# EAGLE design m328prog (EAGLE 9.4.2)
DESIGNER: K. ISOM
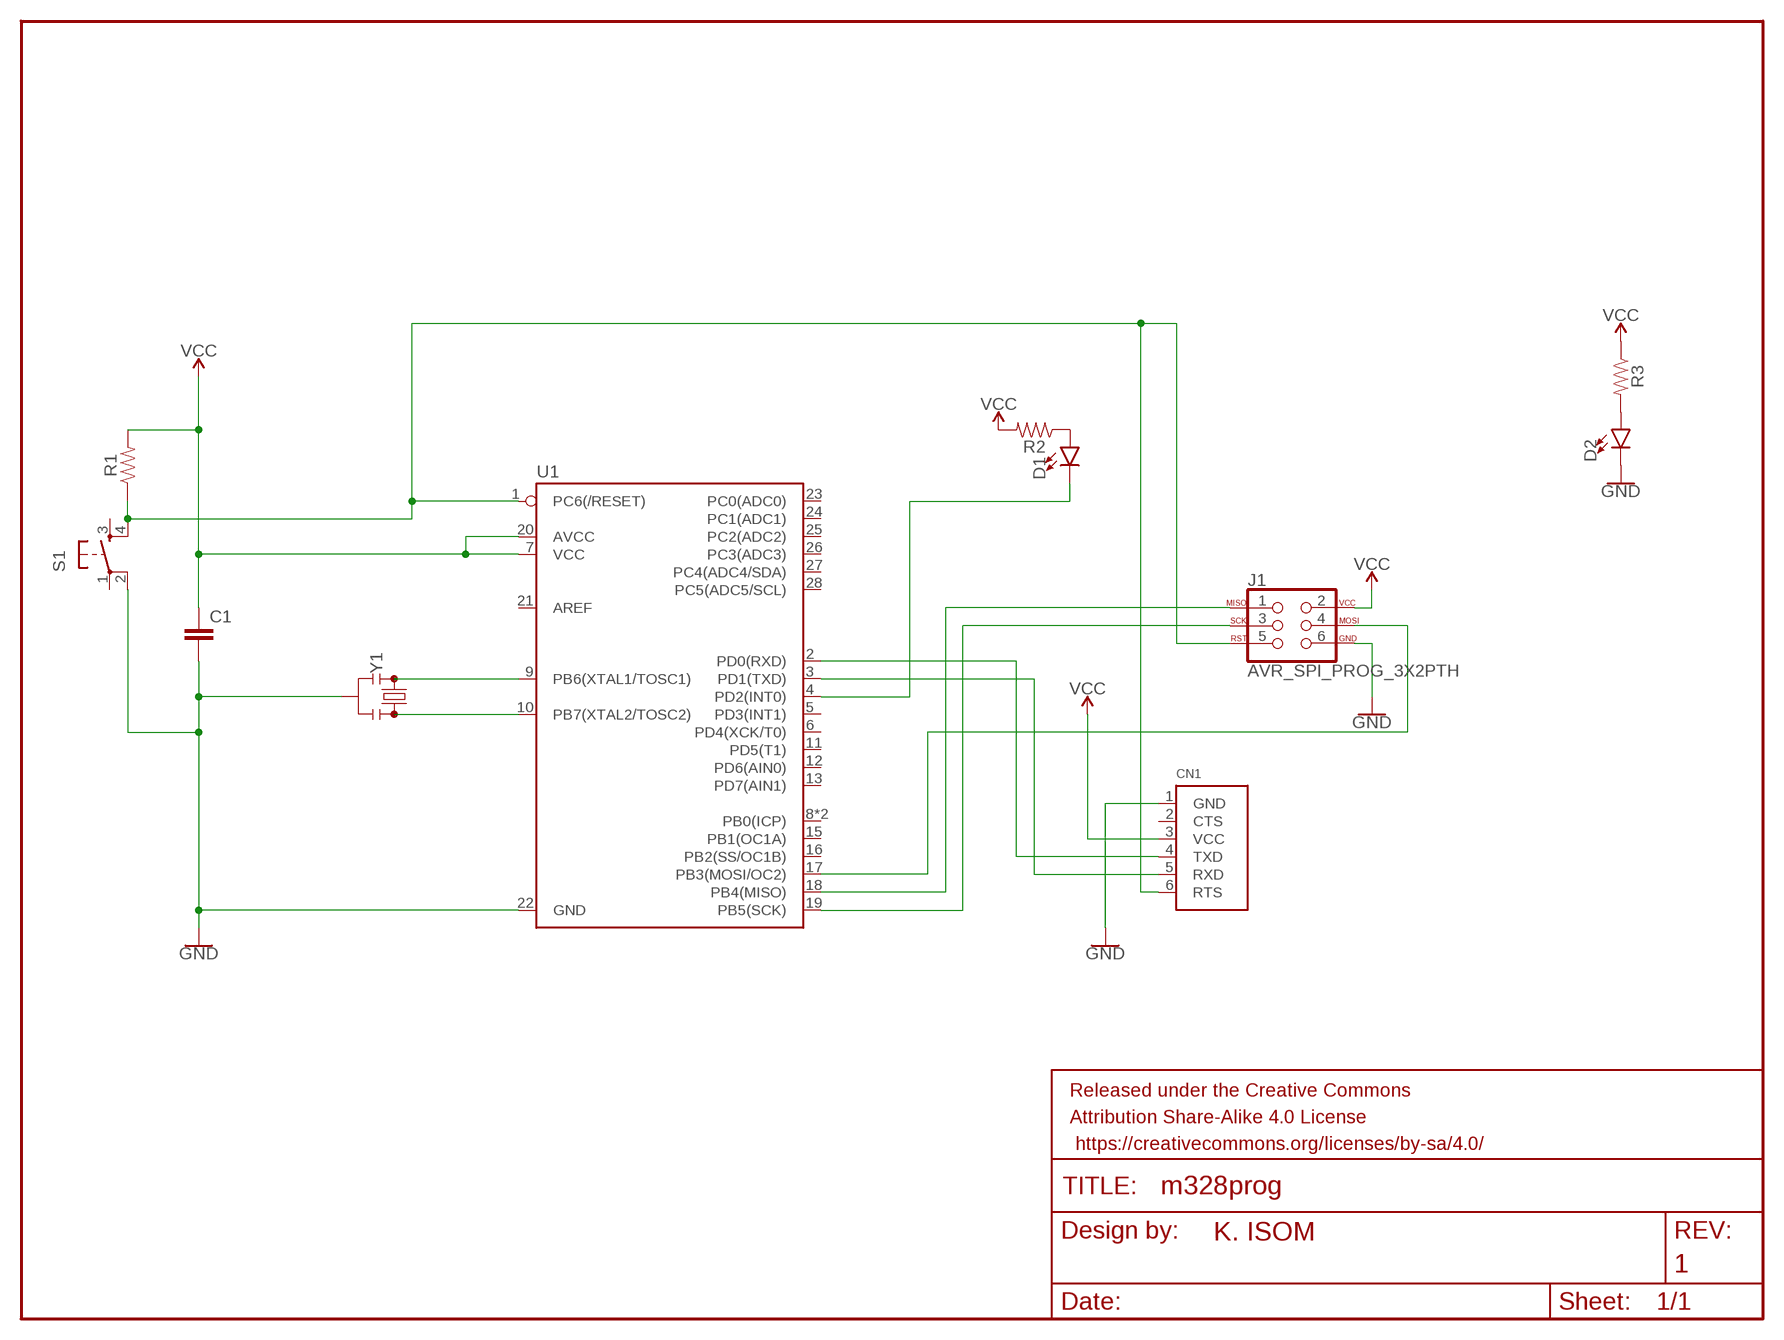
[diagram p0: schematic, sheet 1]

## Parts
C1  C2,5-3  [C2.5-3]
CN1  FTDIUSBCABLE  [1X06_ROUND]
D1  LED3MM  [LED_3MM]
D2  LED3MM  [LED_3MM]
FRAME1  FRAME-LETTER  [CREATIVE_COMMONS]
J1  AVR_SPI_PROG_3X2PTH  [2X3]
R1  RESISTORAXIAL-0.3  [AXIAL-0.3]
R2  RESISTORAXIAL-0.3  [AXIAL-0.3]
R3  RESISTORAXIAL-0.3  [AXIAL-0.3]
S1  TAC_SWITCHPTH  [TACTILE-PTH]
U1  ATMEGA328P  [DIL28-3-ZIF_SOCKET]
Y1  RESONATORPTH-7.6X3.8  [RESONATOR-PTH-7.6X3.8]

## Nets
GND: C1.2 CN1.1(GND) D2.K(C) J1.6 S1.2 U1.22(GND) Y1.2
N$1: U1.9(PB6(XTAL1/TOSC1)) Y1.1
N$2: U1.10(PB7(XTAL2/TOSC2)) Y1.3
N$3: J1.4 U1.17(PB3(MOSI/OC2))
N$4: CN1.6(RTS) J1.5 R1.P$1 S1.4 U1.1(PC6(/RESET))
N$5: J1.1 U1.18(PB4(MISO))
N$6: J1.3 U1.19(PB5(SCK))
N$7: D1.K(C) U1.4(PD2(INT0))
N$8: D1.A R2.P$1
N$9: CN1.5(RXD) U1.3(PD1(TXD))
N$10: CN1.4(TXD) U1.2(PD0(RXD))
N$11: D2.A R3.P$2
VCC: C1.1 CN1.3(VCC) J1.2 R1.P$2 R2.P$2 R3.P$1 U1.7(VCC) U1.20(AVCC)
Unconnected: CN1.2(CTS) S1.1 S1.3 U1.5(PD3(INT1)) U1.6(PD4(XCK/T0)) U1.8(PB0(ICP)) U1.11(PD5(T1)) U1.12(PD6(AIN0)) U1.13(PD7(AIN1)) U1.14(PB0(ICP)) U1.15(PB1(OC1A)) U1.16(PB2(SS/OC1B)) U1.21(AREF) U1.23(PC0(ADC0)) U1.24(PC1(ADC1)) U1.25(PC2(ADC2)) U1.26(PC3(ADC3)) U1.27(PC4(ADC4/SDA)) U1.28(PC5(ADC5/SCL))

## Library data of the parts
C1 = capacitor-wima:C: CAPACITOR naming: grid - package width
CN1 = microbuilder:FTDIUSBCABLE: FTDI TTL-232R USB Cable Connector for FTDI's USB->RS232 Cable
D1 D2 = SparkFun-LED:LED: LED (Generic) Standard schematic elements and footprints for 5mm, 3mm, 1206, and 0603 sized LEDs. Generic LEDs with no color specified.; PROD_ID: DIO-08794
FRAME1 = SparkFun-Aesthetics:FRAME-LETTER: Schematic Frame - Letter Standard 8.5x11 US Letter frame; DESIGNER: K. ISOM; REV: 1
J1 = SparkFun-Connectors:AVR_SPI_PROG_3X2: AVR ISP 6 Pin This is the reduced ISP connector for AVR programming. Common on Arduino. This footprint will take up less PCB space and can be used with a 10-pin to 6-pin adapter such as SKU: BOB-08508 **Special note about "TEST_POINT" package. The stop mask is on the top side, so if you want your programming test points to be on the bottom of your board, make sure to place this package on the bottom side of the board. This also ensure that the orientation to program from the bottom side will be correct. SparkFun Products: SparkFun ISP Pogo Adapter <https://www.sparkfun.com/products/11591> - NS Tiny AVR Programmer <https://www.sparkfun.com/products/11801> -PTH
R1-R3 = SparkFun-Resistors:RESISTOR: Generic Resistor Package
S1 = SparkFun-Retired:TAC_SWITCH: Momentary Switch Button commonly used for reset or general input. Spark Fun Electronics SKU : COM-00097 SMT- SWCH-08247
U1 = wntrmute:ATMEGA328P
Y1 = SparkFun-Clocks:RESONATOR: Resonators (Generic) Ceramic resonators are clock-generating components, often used to control timing in microcontrollers. They usually have 3 pins: two pins for oscillation, and one pin for ground. Compared to crystals, resonators have worse tolerance, but are usually much cheaper. Plus, they have built-in load capacitors! These devices are used on boards like the Arduino Pro 8MHz <https://www.sparkfun.com/products/11114> and Arduino Pro 16MHz <https://www.sparkfun.com/products/11113>.

## Net classes
0 default: width 0.152 mm, drill 0.254 mm, clearance 0.152 mm

## Board
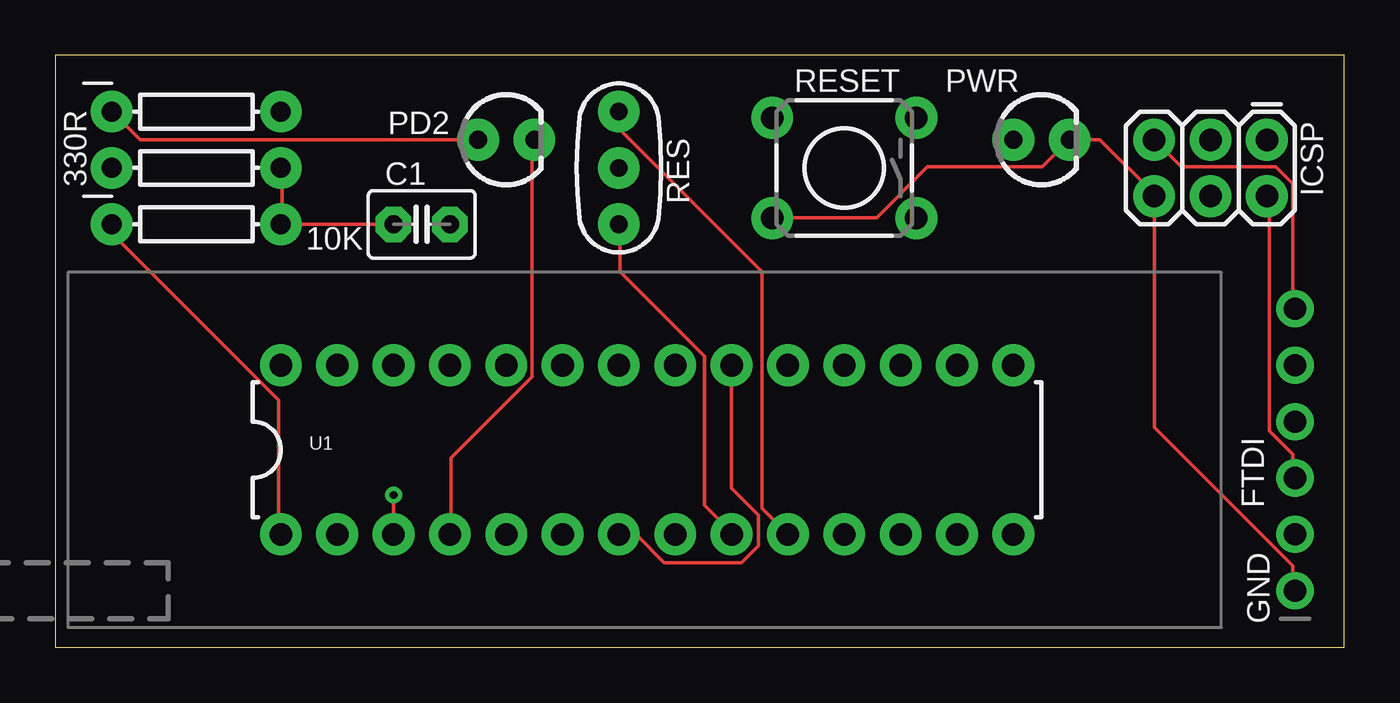
[diagram p1: board, top side]
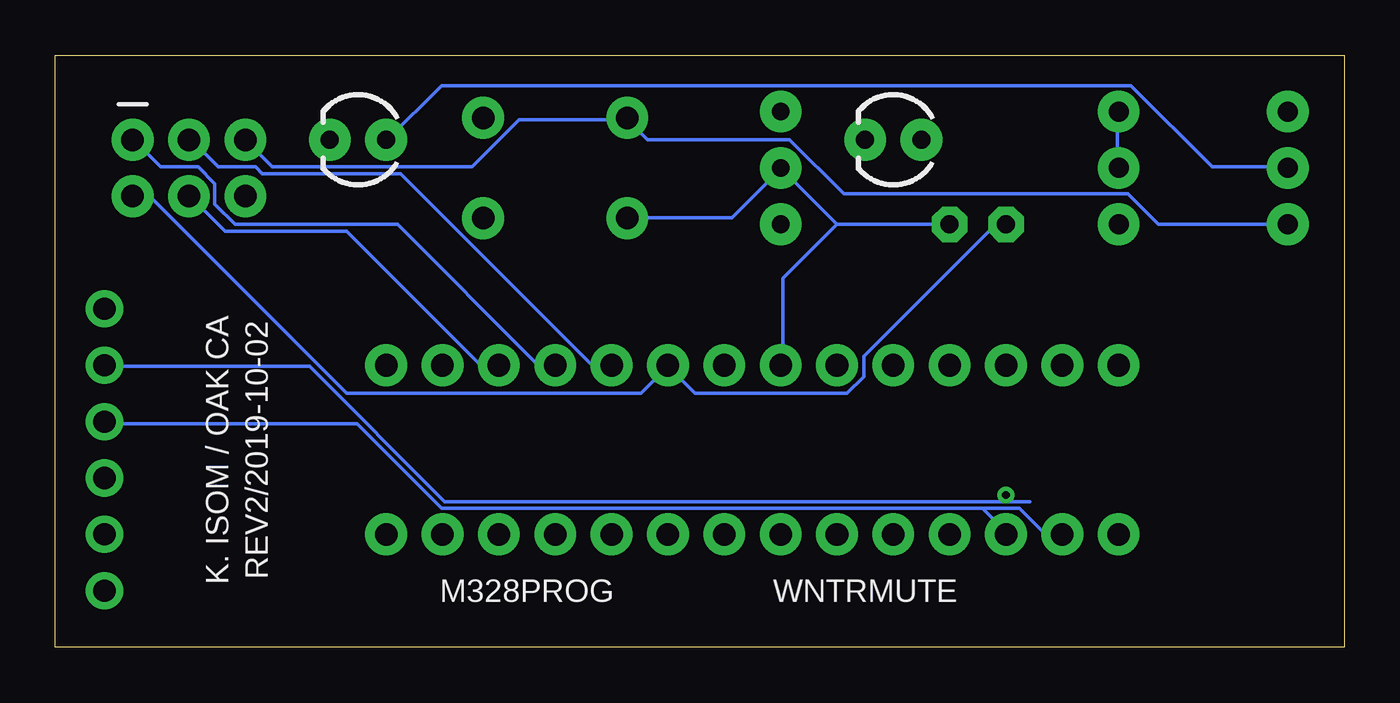
[diagram p2: board, bottom side, seen from below]

Size 58.09 x 26.66 mm. Coordinates in mm from the lower left corner, seen from the top.
Outline: 0,0 58.09,0 58.09,26.66 0,26.66 0,0
Copper layers (1*16): Top 0.035mm / dielectric 1.5mm / Bottom 0.035mm
Design rules "default": minimum track width 6mil, minimum drill 0.35mm, track to track 6mil, track to pad 6mil, pad to pad 6mil, via to via 6mil, smd to smd 6mil, copper to edge 40mil, drill to drill 6mil, minimum pad ring 10mil, minimum via ring 8mil, stop-mask expansion 4mil, vias tented up to drill 0mil, thermal gap 10mil

### Footprints (pad centres in the part's own frame; a part is rotated, then mirrored left to right if it is on the bottom)
C2.5-3 = drill 0.813 pad 1.6 octagon: 1 -1.27,0; 2 1.27,0
1X06_ROUND = drill 1 pad 1.676: 1 -6.35,0; 2 -3.81,0; 3 -1.27,0; 4 1.27,0; 5 3.81,0; 6 6.35,0
LED_3MM = drill 0.813 pad 1.88: A -1.27,0; K 1.27,0
2X3 = drill 1.016 pad 1.88: 1 0,0; 2 0,2.54; 3 2.54,0; 4 2.54,2.54; 5 5.08,0; 6 5.08,2.54
AXIAL-0.3 = drill 0.9 pad 1.88: P$1 -3.81,0; P$2 3.81,0
TACTILE-PTH = drill 1.016 pad 1.88: 1 -3.251,2.261; 2 3.251,2.261; 3 -3.251,-2.261; 4 3.251,-2.261
DIL28-3-ZIF_SOCKET = drill 1.016 pad 1.88: 1 -16.51,-3.81; 2 -13.97,-3.81; 3 -11.43,-3.81; 4 -8.89,-3.81; 5 -6.35,-3.81; 6 -3.81,-3.81; 7 -1.27,-3.81; 8 1.27,-3.81; 9 3.81,-3.81; 10 6.35,-3.81; 11 8.89,-3.81; 12 11.43,-3.81; 13 13.97,-3.81; 14 16.51,-3.81; 15 16.51,3.81; 16 13.97,3.81; 17 11.43,3.81; 18 8.89,3.81; 19 6.35,3.81; 20 3.81,3.81; 21 1.27,3.81; 22 -1.27,3.81; 23 -3.81,3.81; 24 -6.35,3.81; 25 -8.89,3.81; 26 -11.43,3.81; 27 -13.97,3.81; 28 -16.51,3.81
RESONATOR-PTH-7.6X3.8 = drill 0.8 pad 1.88: 1 -2.54,0; 2 0,0; 3 2.54,0

### Placement (x,y rotation side)
C1  16.51,19.05 0 top
CN1  55.88,8.89 90 top
D1  20.32,22.86 0 top
D2  44.45,22.86 0 top
FRAME1  11.43,-8.89 0 top  (outside the outline)
J1  54.61,22.86 180 top
R1  6.35,19.05 0 top
R2  6.35,24.13 0 top
R3  6.35,21.59 180 top
S1  35.56,21.59 180 top
U1  26.67,8.89 0 top
Y1  25.4,21.59 90 top

### Tracks (layer width: path | path; a pad name or v marks a point on that pad's centre or on a via)
GND
  Top 0.152: CN1.1 55.78,2.59 55.78,3.66 49.53,9.91 J1.6 49.53,20.42 47.09,22.86 D2.K 44.5,21.64 39.32,21.64 37.03,19.36 32.31,19.36 S1.2
  Bottom 0.152: 22.86,19.05 C1.2 | 22.86,19.05 Y1.2 25.45,21.49 27.58,19.36 32.31,19.36 S1.2 | 22.86,19.05 25.3,16.61 25.3,12.8 U1.22
N$1
  Top 0.152: Y1.1 25.45,19.05 25.45,16.92 29.26,13.11 29.26,6.4 30.48,5.18 U1.9
N$2
  Top 0.152: U1.10 31.85,6.25 31.85,16.92 25.45,23.32 25.45,24.08 Y1.3
N$3
  Bottom 0.152: U1.17 38.1,12.8 39.01,12.8 44.96,18.75 50.44,18.75 51.97,20.27 J1.4
N$4
  Top 0.152: U1.1 10.06,5.18 10.06,11.12 2.59,18.59 2.59,19.05 R1.P$1 | J1.5 50.75,21.64 55.02,21.64 55.78,20.88 55.78,15.24 CN1.6
  Bottom 0.152: 32.31,23.77 37.19,23.77 39.32,21.64 48.31,21.64 J1.5 | R1.P$1 8.38,19.05 9.75,20.42 22.55,20.42 24.99,22.86 31.39,22.86 32.31,23.77 | 32.31,23.77 S1.4
N$5
  Bottom 0.152: U1.18 35.66,12.8 36.42,12.8 42.67,19.05 49.99,19.05 50.9,19.96 50.9,20.88 51.66,21.64 53.34,21.64 54.56,22.86 J1.1
N$6
  Bottom 0.152: U1.19 33.07,12.8 33.98,12.8 42.52,21.34 48.77,21.34 49.07,21.64 50.75,21.64 51.97,22.86 J1.3
N$7
  Top 0.152: U1.4 17.83,5.18 17.83,8.53 21.49,12.19 21.49,22.86 D1.K
N$8
  Top 0.152: D1.A 3.81,22.86 R2.P$1
N$9  (via drill 0.35)
  Top 0.152: v15.24,6.86 U1.3
  Bottom 0.152: 14.17,6.55 15.24,6.55 | 15.24,6.55 40.54,6.55 46.63,12.65 55.78,12.65 CN1.5 | 15.24,6.55 v15.24,6.86
N$10
  Bottom 0.152: 16.31,6.25 40.69,6.25 44.5,10.06 55.78,10.06 CN1.4 | 15.24,5.18 16.31,6.25 | 16.31,6.25 14.63,6.25 13.56,5.18 12.8,5.18 U1.2
N$11
  Bottom 0.152: R3.P$2 2.59,21.64 5.94,21.64 9.6,25.3 40.69,25.3 43.13,22.86 D2.A
VCC
  Top 0.152: CN1.3 55.78,7.62 55.78,8.69 54.71,9.75 54.71,20.27 J1.2 | 10.21,19.05 C1.1 | 10.21,19.05 10.21,21.49 R3.P$1 | 10.21,19.05 R1.P$2 | U1.20 30.48,7.16 31.7,5.94 31.7,4.57 30.94,3.81 27.43,3.81 26.21,5.03 25.45,5.03 U1.7
  Bottom 0.152: R3.P$1 10.21,21.64 10.21,24.08 R2.P$2 | C1.1 15.7,19.05 21.64,13.11 21.64,12.19 22.4,11.43 29.26,11.43 30.48,12.65 | 30.48,12.65 31.7,11.43 44.96,11.43 53.8,20.27 54.56,20.27 J1.2 | 30.48,12.65 U1.20

### Text on the board
tPlace: RESET | PWR | PD2 | 330R | RES | ICSP | 10K | FTDI | GND
bPlace: REV2/2019-10-02 | K. ISOM / OAK CA | WNTRMUTE | M328PROG